# Altium schematic sheet P1.schdoc
size 297 x 209 mm; Symbol: Drawing-Symbol_A4; @Project Name: Weather-Station; @Page Count: 1; @Update Date: 2026-03-27; @Create Date: 2025-12-29; @Schematic Name: User Interface; @Page No: 1; @Page Name: P1; Company: EasyEDA.com; Version: V1.0; Page Size: A4; @Create Time: 09:15:50; @Update Time: 09:50:23; Border: 1; Width: 1170; Height: 825; Region Start: 1; X Region Count: 6; Y Region Count: 4; Blade Width: 10; Title Block Position: 3; @Board Name: UI-Board; Device: Drawing-Symbol_A4
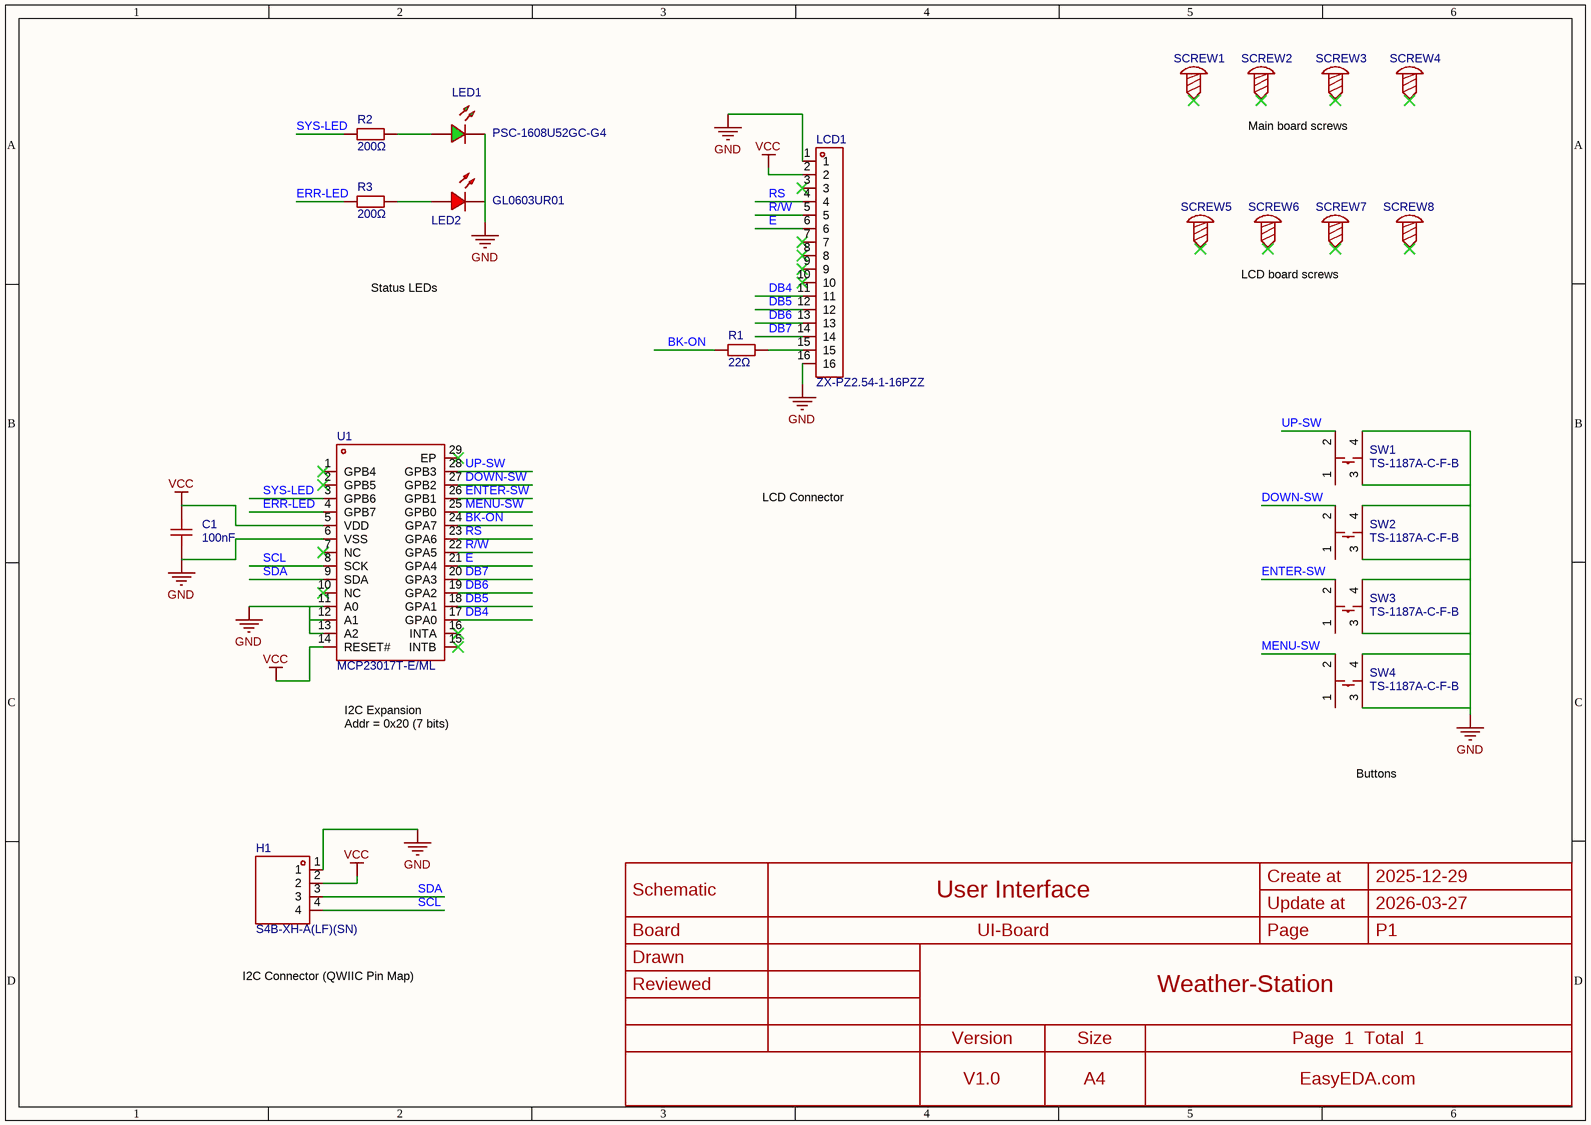
[diagram p0: P1.schdoc]

## Parts
C1  100nF  [C0402]
H1  S4B-XH-A(LF)(SN)  [CONN-TH_S4B-XH-A-LF-SN]
LCD1  ZX-PZ2.54-1-16PZZ  [HDR-TH_16P-P2.54-V-M-2]
LED1  PSC-1608U52GC-G4  [LED0603-RD_GREEN]
LED2  GL0603UR01  [LED0603-FD]
R1  22Ω  [R0402]
R2  200Ω  [R0402]
R3  200Ω  [R0402]
SCREW1  (no value)  [Screw-Hole-M3]
SCREW2  (no value)  [Screw-Hole-M3]
SCREW3  (no value)  [Screw-Hole-M3]
SCREW4  (no value)  [Screw-Hole-M3]
SCREW5  (no value)  [Screw-Hole-M3]
SCREW6  (no value)  [Screw-Hole-M3]
SCREW7  (no value)  [Screw-Hole-M3]
SCREW8  (no value)  [Screw-Hole-M3]
SW1  TS-1187A-C-F-B  [SW-SMD_4P-L5.1-W5.1-P3.70-LS6.5-TL_H3.0]
SW2  TS-1187A-C-F-B  [SW-SMD_4P-L5.1-W5.1-P3.70-LS6.5-TL_H3.0]
SW3  TS-1187A-C-F-B  [SW-SMD_4P-L5.1-W5.1-P3.70-LS6.5-TL_H3.0]
SW4  TS-1187A-C-F-B  [SW-SMD_4P-L5.1-W5.1-P3.70-LS6.5-TL_H3.0]
U1  MCP23017T-E/ML  [QFN-28_L6.0-W6.0-P0.65-BL-EP3.7]

## Nets
GND: C1.2 H1.1 LCD1.1 LCD1.16 LED1.1(C) LED2.2(C) SW1.3(C) SW1.4(D) SW2.3(C) SW2.4(D) SW3.3(C) SW3.4(D) SW4.3(C) SW4.4(D) U1.6(VSS) U1.11(A0) U1.12(A1) U1.13(A2)
VCC: C1.1 H1.2 LCD1.2 U1.5(VDD) U1.14(RESET#)
BK-ON: R1.1 U1.24(GPA7)
DB4: LCD1.11 U1.17(GPA0)
DB5: LCD1.12 U1.18(GPA1)
DB6: LCD1.13 U1.19(GPA2)
DB7: LCD1.14 U1.20(GPA3)
DOWN-SW: SW2.2(B) U1.27(GPB2)
E: LCD1.6 U1.21(GPA4)
ENTER-SW: SW3.2(B) U1.26(GPB1)
ERR-LED: R3.1 U1.4(GPB7)
MENU-SW: SW4.2(B) U1.25(GPB0)
R/W: LCD1.5 U1.22(GPA5)
RS: LCD1.4 U1.23(GPA6)
SCL: H1.4 U1.8(SCK)
SDA: H1.3 U1.9(SDA)
SYS-LED: R2.1 U1.3(GPB6)
UP-SW: SW1.2(B) U1.28(GPB3)
NetLCD1_15: LCD1.15 R1.2
NetLED1_2: LED1.2(A) R2.2
NetLED2_1: LED2.1(A) R3.2

Not connected (* = marked no-connect by the designer): LCD1 3* 7* 8* 9* 10*; SCREW1 1*; SCREW2 1*; SCREW3 1*; SCREW4 1*; SCREW5 1*; SCREW6 1*; SCREW7 1*; SCREW8 1*; SW1 1(A); SW2 1(A); SW3 1(A); SW4 1(A); U1 1(GPB4)* 2(GPB5)* 7(NC)* 10(NC)* 15(INTB)* 16(INTA)* 29(EP)*

## Notes on the sheet
- Main board screws
- Status LEDs
- LCD board screws
- LCD Connector
- I2C Expansion
  Addr = 0x20 (7 bits)
- Buttons
- I2C Connector (QWIIC Pin Map)
- Create at
- 2025-12-29
- Schematic
- Board
- User Interface
- UI-Board
- Update at
- Page
- 2026-03-27
- P1
- Drawn
- Reviewed
- Weather-Station
- Version
- V1.0
- Size
- A4
- Page  1  Total  1
- EasyEDA.com

## Library data of the parts
C1 = CL05B104KO5NNNC: Capacitance:100nF Tolerance:±10% Tolerance:±10% Voltage Rating:16V Temperature Coefficient:X7R; Manufacturer: SAMSUNG(三星); Symbol: CAP; AddInBom: yes; ModelId: b7d13df3e9464d7a99d0651d1a5b4d57; ModelName: C0402_L1.0-W0.5-H0.5; ModelTransform: 39.37,19.685,0,0,0,0,0,0,0; Tolerance: ±10%; Voltage Rating: 16V; Temperature Coefficient: X7R; Device: CL05B104KO5NNNC; LCSC Part Name: 100nF ±10% 16V; SupplierPart: C1525; ManufacturerPart: CL05B104KO5NNNC; Supplier Footprint: 0402; JLCPCB Part Class: Basic Part; Datasheet: https://item.szlcsc.com/datasheet/CL05B104KO5NNNC/1877.html; Supplier: LCSC; ConvertToPcb: yes; FootprintName: C0402; Value: 100nF
H1 = S4B-XH-A(LF)(SN): Pins Structure:1x4P Pitch:2.5mm Mounting Type:Right Angle Reference Series:XH Number of Pins:4P Number of Rows:1 Number of PINs Per Row:4 Row Spacing:- Current Rating:3A Contact Material:Brass Contact Plating:Tin Operating Temperature:-25℃~+85℃ Operating; Manufacturer: JST; AddInBom: yes; ModelId: 77a2ced4cba941c49e3f4130b9ad2f4f; ModelTransform: 488.19194,452.755,0,180,0,0,0.591,136.378,-133.858; Pins Structure: 1x4P; Pitch: 2.5mm; Reference Series: XH; Number of PINs Per Row: 4; Current Rating: 3A; Voltage Rating: 250V; Plastic Material: PA66; Flame Retardant Rating: UL94V-0; Supplementary Features: K Pin; Z-Height of the Board: 6.1mm; X-Length of Bottom Edge on Board (Spacing Line): 12.4mm; Y-Width of Bottom Edge on Board: 11.5mm; Symbol: S4B-XH-A (LF)(SN); Device: S4B-XH-A(LF)(SN); LCSC Part Name: 1x4P 间距:2.5mm 弯插 系列:XH; SupplierPart: C157925; ManufacturerPart: S4B-XH-A(LF)(SN); Supplier Footprint: 弯插,P=2.5mm; JLCPCB Part Class: Extended Part; Datasheet: https://item.szlcsc.com/datasheet/S4B-XH-A(LF)(SN)/169273.html; Supplier: LCSC; ConvertToPcb: yes; FootprintName: CONN-TH_S4B-XH-A-LF-SN; ModelName: CONN-TH_S4B-XH-A-LF-SN; Mounting Type: Right Angle; Number of Pins: 4P; Number of Rows: 1; Row Spacing: -; Contact Material: Brass; Contact Plating: Tin; Operating Temperature: -25℃~+85℃; Color: White
LCD1 = ZX-PZ2.54-1-16PZZ: Pin Structure:1x16P Pitch:2.54mm Row Spacing:- Circluar Pins/Square Pins:Pin Header Mounting Type:Through Hole Number of Rows:1 Number of Pins:16P Current Rating:3A Voltage Rating (Max):- Length of Mating Pin:6mm Insulation Height:2.5mm Length of End Conn; Manufacturer: Megastar(兆星); Symbol: HDR_2.54-1x16P; AddInBom: yes; ModelId: 24ed36a50e074be09de6fbf6b56dab1a; ModelTransform: 1592.16225,98.425,0,0,0,0,0,0,-118.11; Pin Structure: 1x16P; Pitch: 2.54mm; Current Rating: 3A; Device: ZX-PZ2.54-1-16PZZ; LCSC Part Name: 1x16P 间距:2.54mm 方针 直插; SupplierPart: C7501270; ManufacturerPart: ZX-PZ2.54-1-16PZZ; Supplier Footprint: 插件,P=2.54mm; JLCPCB Part Class: Extended Part; Datasheet: https://item.szlcsc.com/datasheet/ZX-PZ2.54-1-16PZZ/8582483.html; Supplier: LCSC; ConvertToPcb: yes; FootprintName: HDR-TH_16P-P2.54-V-M-2; ModelName: HDR-TH_16P-P2.54-V-M-2; Row Spacing: -; Circluar Pins/Square Pins: Pin Header; Mounting Type: Through Hole; Number of Rows: 1; Number of Pins: 16P; Voltage Rating (Max): -; Length of Mating Pin: 6mm; Insulation Height: 2.5mm; Length of End Connection Pin: 3mm; Contact Material: Brass; Contact Plating: Gold; Operating Temperature: -40℃~+105℃; Color: Black
LED1 = PSC-1608U52GC-G4: Illumination Color:Green Voltage - Forward(Vf):3.1V Voltage - Forward(Vf):3.1V Power(Watts):66mW Forward Current:10mA Wavelength - Dominant:517nm~527nm Wavelength - Dominant:517nm~527nm Lens Color:Water Clear Luminous Intensity:780mcd Luminous Intensity:7; Manufacturer: HONGLITRONIC(鸿利光电); Symbol: LED_G; AddInBom: yes; ModelId: a9cdc1fbf7c645558838e51af9c6951f; ModelTransform: 63.7794,31.496,0,0,0,0,0,0,0; Illumination Color: Green; Voltage - Forward(Vf): 3.1V; Power(Watts): 66mW; Forward Current: 10mA; Luminous Intensity: 780mcd; Viewing Angle: 130°; Device: PSC-1608U52GC-G4; LCSC Part Name: 钻孔1608低亮绿灯; SupplierPart: C22371297; ManufacturerPart: PSC-1608U52GC-G4; Supplier Footprint: 0603; JLCPCB Part Class: Extended Part; Datasheet: https://item.szlcsc.com/datasheet/PSC-1608U52GC-G4/23857064.html; Supplier: LCSC; ConvertToPcb: yes; FootprintName: LED0603-RD_GREEN; ModelName: LED0603-RD_GREEN; Wavelength - Dominant: 517nm~527nm; Lens Color: Water Clear; Operating Temperature: -40℃~+85℃
LED2 = GL0603UR01: Illumination Color:Red Voltage - Forward(Vf):2.4V Voltage - Forward(Vf):2.4V Forward Current:20mA Wavelength - Dominant:620nm~625nm Wavelength - Dominant:620nm~625nm Diode Configuration:Discrete Diode Lens Color:Water Clear Luminous Intensity:120mcd Lumin; Manufacturer: Guiguang light(桂光光电); Symbol: LED_R; AddInBom: yes; ModelId: fde3ab7d2585474cbe7c93bfe55424d4; ModelName: LED0603_Inf; ModelTransform: 60,30,0,0,0,0,0,0,0; Illumination Color: Red; Voltage - Forward(Vf): 2.4V; Forward Current: 20mA; Luminous Intensity: 120mcd; Viewing Angle: 120°; Device: GL0603UR01; LCSC Part Name: 0603 红灯 高亮; SupplierPart: C51933292; ManufacturerPart: GL0603UR01; Supplier Footprint: 0603; JLCPCB Part Class: Extended Part; Datasheet: https://item.szlcsc.com/datasheet/GL0603UR01/54645988.html; Supplier: LCSC; ConvertToPcb: yes; FootprintName: LED0603-FD; Wavelength - Dominant: 620nm~625nm; Diode Configuration: Discrete Diode; Lens Color: Water Clear; Mounting Style: Top-mount; Operating Temperature: -40℃~+85℃
R1 = SCR0402F22R: Type:Thick Film Resistors Resistance: Tolerance:±1% Tolerance:±1% Power(Watts): Overload Voltage (Max): Operating Temperature Range:-55℃~+155℃ Operating Temperature Range:-55℃~+155℃; Manufacturer: VO(翔胜); Symbol: Res; AddInBom: yes; ModelId: efdecb7dae4442949d28eecaf748420f; ModelName: R0402_L1.0-W0.5-H0.4; ModelTransform: 39.37,19.685,0,0,0,0,0,0,0; Tolerance: ±1%; Device: SCR0402F22R; LCSC Part Name: 厚膜电阻 22Ω ±1% 62.5mW; SupplierPart: C3015957; ManufacturerPart: SCR0402F22R; Supplier Footprint: 0402; JLCPCB Part Class: Extended Part; Datasheet: https://atta.szlcsc.com/upload/public/pdf/source/20220513/247AF9639BA21CF93567DC289CCC6A22.pdf; Supplier: LCSC; ConvertToPcb: yes; FootprintName: R0402; Type: Thick Film Resistors; Value: 22Ω; Operating Temperature Range: -55℃~+155℃
R2 R3 = GR0402F200RTAG00: Type:Thick Film Resistor Resistance:200Ω Tolerance:±1% Tolerance:±1% Power(Watts):62.5mW Voltage-Supply(Max):50V Operating Temperature:-55℃~+155℃ Operating Temperature:-55℃~+155℃; Manufacturer: GiantOhm(鼎声微电); Symbol: Res; AddInBom: yes; ModelId: efdecb7dae4442949d28eecaf748420f; ModelName: R0402_L1.0-W0.5-H0.4; ModelTransform: 39.37,19.685,0,0,0,0,0,0,0; Tolerance: ±1%; Power(Watts): 62.5mW; Voltage-Supply(Max): 50V; Device: GR0402F200RTAG00; LCSC Part Name: 200R ±1%; SupplierPart: C49655161; ManufacturerPart: GR0402F200RTAG00; Supplier Footprint: 0402; JLCPCB Part Class: Extended Part; Datasheet: https://item.szlcsc.com/datasheet/GR0402F200RTAG00/52212750.html; Supplier: LCSC; ConvertToPcb: yes; FootprintName: R0402; Type: Thick Film Resistor; Value: 200Ω; Operating Temperature: -55℃~+155℃
SCREW1-SCREW8 = Screw-Hole-M3: Add into BOM: no; ConvertToPcb: yes; Device: Screw-Hole-M3; Supplier Footprint: 插件; SymbolName: Screw-Hole; FootprintName: Screw-Hole-M3
SW1-SW4 = TS-1187A-C-F-B: Circuit:SPST Actuator Style:Round Button Operating Force:2.6N Mounting Type:Surface Mount,Vertical Length:5.1mm Width:5.1mm Switch Height:3mm with Bracket:Without Bracket Contact Current:50mA Voltage Rating:12V Actuator/Cap Color:Gold With Lamp:No Life:10; Manufacturer: XKB Connection(中国星坤); AddInBom: yes; ModelId: 76c7d33cdaf04d3ba64fc8b9a37b331b0819f05c4eef4c71ace90d822a990e87; ModelTransform: 255.905,204.76337,0,0,0,0,-0.001,0.002,0; Circuit: SPST; Operating Force: 2.6N; Switch Height: 3mm; Contact Current: 50mA; Voltage Rating: 12V; Actuator/Cap Color: Gold; With Lamp: No; Life: 100,000 Cycles; Symbol: TS-1187A-C-F-B; Device: TS-1187A-C-F-B; LCSC Part Name: 5.1*5.1*3mm 立贴 轻触开关; SupplierPart: C571338; ManufacturerPart: TS-1187A-C-F-B; Supplier Footprint: SMD; JLCPCB Part Class: Extended Part; Datasheet: https://item.szlcsc.com/datasheet/TS-1187A-C-F-B/597311.html; Supplier: LCSC; ConvertToPcb: yes; FootprintName: SW-SMD_4P-L5.1-W5.1-P3.70-LS6.5-TL_H3.0; ModelName: SW-SMD_4P-L5.1-W5.1-P3.70-LS6.5-TL_H3.0; Actuator Style: Round Button; Mounting Type: Surface Mount,Vertical; Length: 5.1mm; Width: 5.1mm; with Bracket: Without Bracket; Operating Temperature: -30℃~+85℃
U1 = MCP23017T-E/ML: Interface:- Number of I/O:16 Interrupt Output:With Interrupt Output Output Type:- Voltage - Supply:1.8V~5.5V Voltage - Supply:1.8V~5.5V Current - Output Low(IOL):- Current - Output High(IOH):- Clock Frequency:- Operating Temperature:-40℃~+125℃ Operating T; Manufacturer: MICROCHIP(美国微芯); AddInBom: yes; ModelId: f4c4e50866404e7e84bdc37b3613ab61; ModelTransform: 237.007,237.007,0,90,0,0,0,0,0; Number of I/O: 16; Symbol: MCP23017T-E/ML; Device: MCP23017T-E/ML; LCSC Part Name: 16位带串行接口的I/O扩展器; SupplierPart: C629439; ManufacturerPart: MCP23017T-E/ML; Supplier Footprint: QFN-28-EP(6x6); JLCPCB Part Class: Extended Part; Datasheet: https://item.szlcsc.com/datasheet/MCP23017T-E%252FML/659238.html; Supplier: LCSC; ConvertToPcb: yes; FootprintName: QFN-28_L6.0-W6.0-P0.65-BL-EP3.7; ModelName: QFN-28_L6.0-W6.0-P0.65-BL-EP3.7; Interface: -; Interrupt Output: With Interrupt Output; Output Type: -; Voltage - Supply: 1.8V~5.5V; Current - Output Low(IOL): -; Current - Output High(IOH): -; Clock Frequency: -; Operating Temperature: -40℃~+125℃